# Altium schematic sheet Ethernet_Interface.SchDoc: STM32F446 CNC
size B; Author: AM; CompanyName: Expatria Technologies; DrawnBy: A.Marles; Engineer: AM; Organization: Expatria Technolgoies; Address1: PO Box 2084; Address3: Merritt, BC V1K 1B8; Address4: Canada; DocumentNumber: 7; SheetNumber: 7; SheetTotal: 26
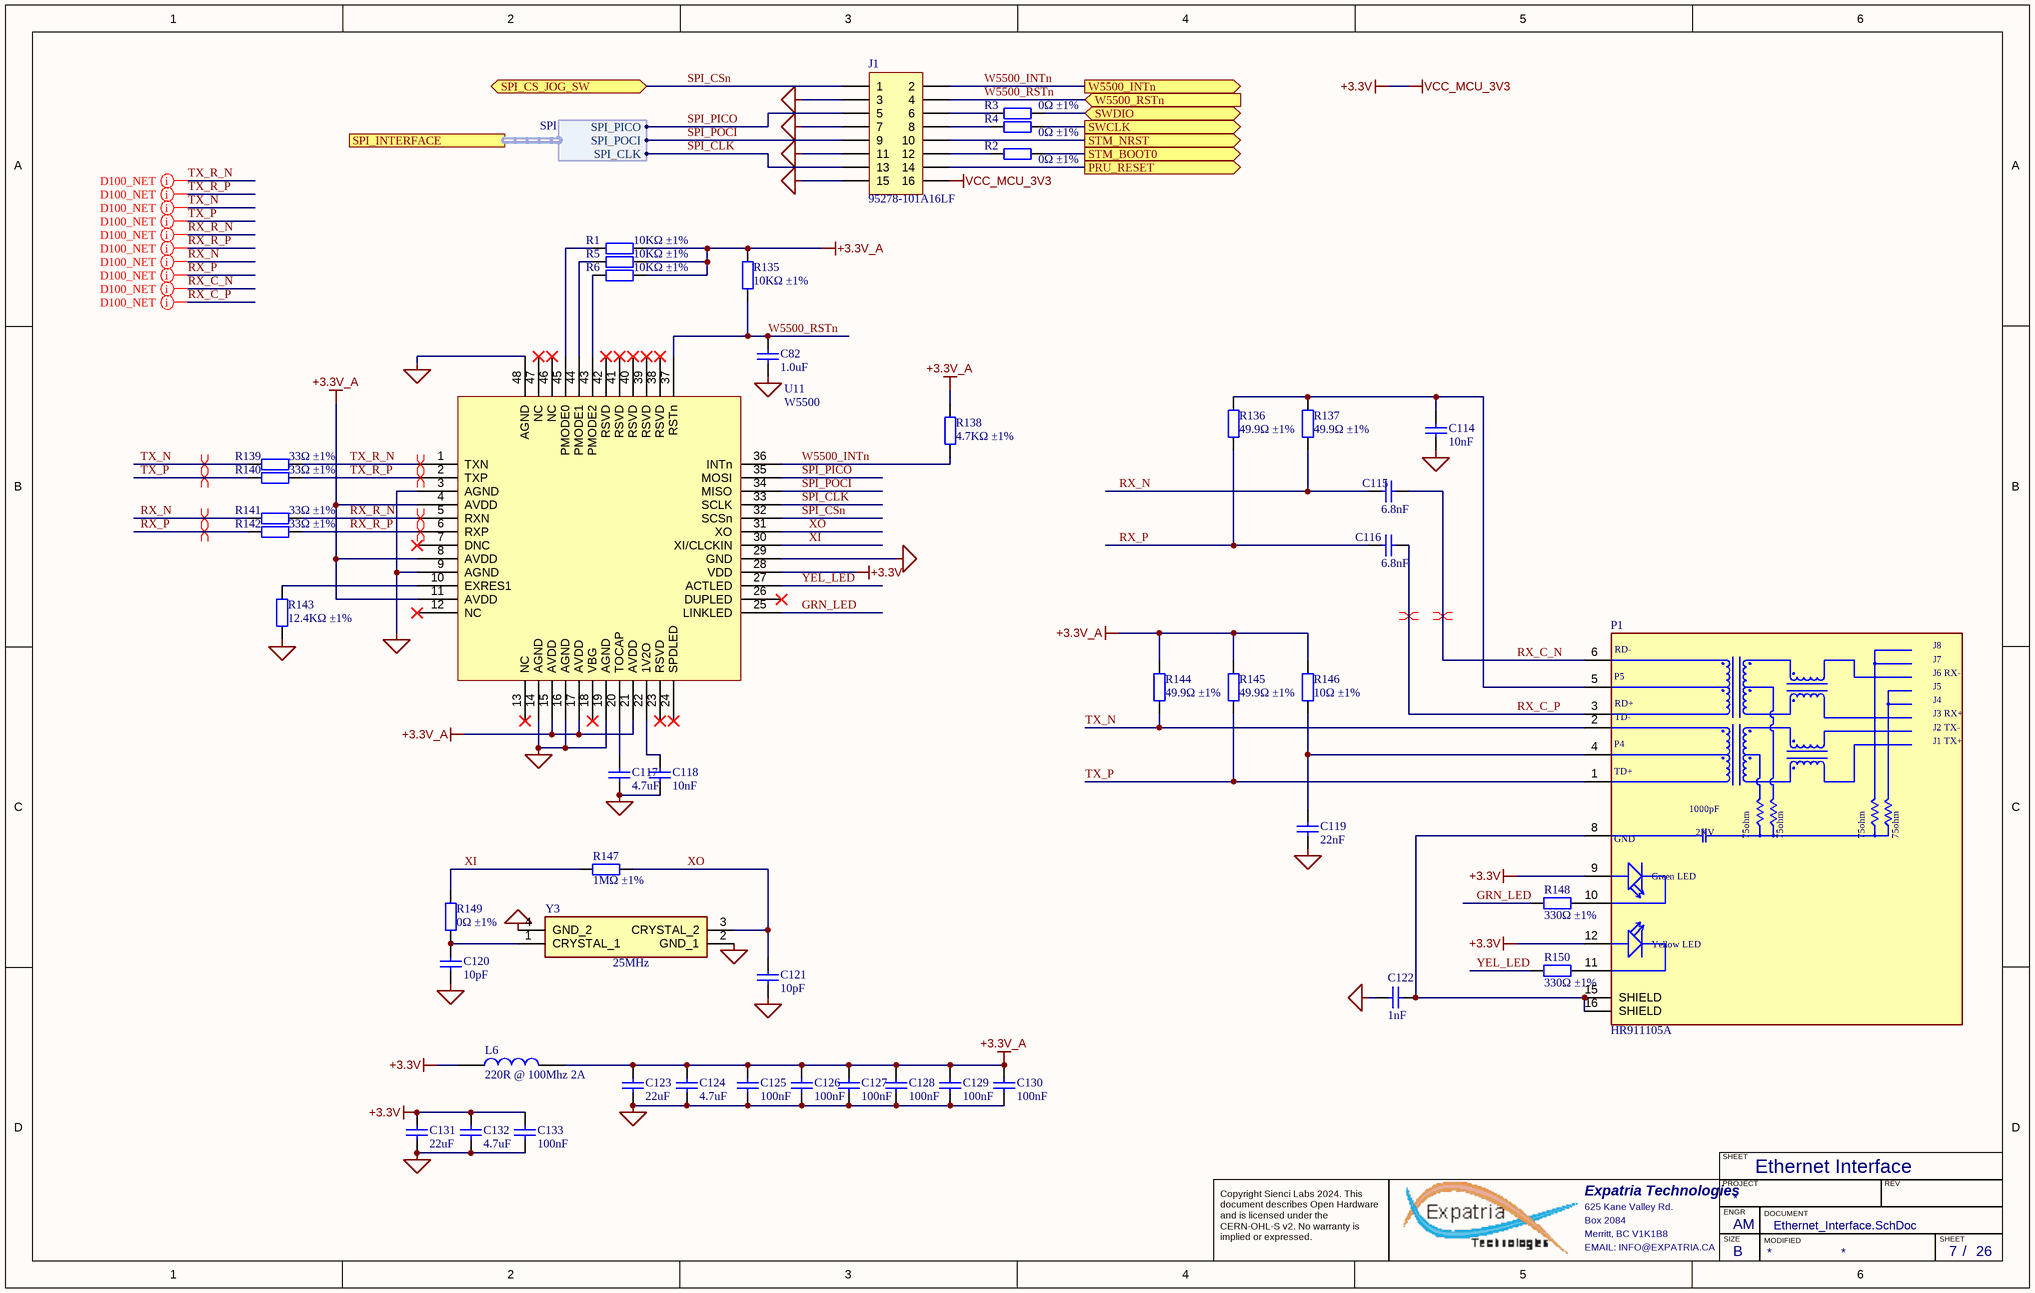
[diagram p0: Ethernet_Interface.SchDoc]

## Parts
C82  1.0uF  [0402_C]
C114  10nF  [0402_C]
C115  6.8nF  [0402_C]
C116  6.8nF  [0402_C]
C117  4.7uF  [0402_C]
C118  10nF  [0402_C]
C119  22nF  [0402_C]
C120  10pF  [0402_C]
C121  10pF  [0402_C]
C122  1nF  [1206_C]
C123  22uF  [0805_C]
C124  4.7uF  [0603_C]
C125  100nF  [0402_C]
C126  100nF  [0402_C]
C127  100nF  [0402_C]
C128  100nF  [0402_C]
C129  100nF  [0402_C]
C130  100nF  [0402_C]
C131  22uF  [0805_C]
C132  4.7uF  [0603_C]
C133  100nF  [0402_C]
J1  95278-101A16LF  [95278101A16LF]
L6  220R @ 100Mhz 2A  [0805_R]
P1  HR911105A  [HANRUN_HR911105A]
R1  10KΩ ±1%  [0402_R]
R2  0Ω ±1%  [0603_R]
R3  0Ω ±1%  [0603_R]
R4  0Ω ±1%  [0603_R]
R5  10KΩ ±1%  [0402_R]
R6  10KΩ ±1%  [0402_R]
R135  10KΩ ±1%  [0402_R]
R136  49.9Ω ±1%  [0402_R]
R137  49.9Ω ±1%  [0402_R]
R138  4.7KΩ ±1%  [0402_R]
R139  33Ω ±1%  [0402_R]
R140  33Ω ±1%  [0402_R]
R141  33Ω ±1%  [0402_R]
R142  33Ω ±1%  [0402_R]
R143  12.4KΩ ±1%  [0603_R]
R144  49.9Ω ±1%  [0402_R]
R145  49.9Ω ±1%  [0402_R]
R146  10Ω ±1%  [0402_R]
R147  1MΩ ±1%  [0402_R]
R148  330Ω ±1%  [0402_R]
R149  0Ω ±1%  [0402_R]
R150  330Ω ±1%  [0402_R]
U11  W5500  [LQFP-48_7x7x05P]
Y3  value 25MHz  [YSX321SL]  (hidden comment: X322525MSB4SI)

## Ports
PRU_RESET (out), SPI_CS_JOG_SW (bidir), SPI_INTERFACE (harness SPI), STM_BOOT0 (out), STM_NRST (out), SWCLK (out), SWDIO (bidir), W5500_INTn (out), W5500_RSTn (in)

## Harnesses
SPI: SPI_CLK, SPI_PICO, SPI_POCI

## Nets
+3.3V: C131.2 C132.2 C133.2 J1.16 L6.1 P1.9(GA) P1.12(YA) U11.28(VDD)  [also labelled VCC_MCU_3V3]
+3.3V_A: C123.2 C124.2 C125.2 C126.2 C127.2 C128.2 C129.2 C130.2 L6.2 R1.1 R5.1 R6.1 R135.1 R138.1 R144.1 R145.1 R146.1 U11.4(AVDD) U11.8(AVDD) U11.11(AVDD) U11.15(AVDD) U11.17(AVDD) U11.21(AVDD)
MCU_GND: C82.1 C114.1 C117.1 C118.1 C119.1 C120.1 C121.1 C122.1 C123.1 C124.1 C125.1 C126.1 C127.1 C128.1 C129.1 C130.1 C131.1 C132.1 C133.1 J1.3 J1.7 J1.11 J1.15 R143.1 U11.3(AGND) U11.9(AGND) U11.14(AGND) U11.16(AGND) U11.19(AGND) U11.29(GND) U11.48(AGND) Y3.2(GND_1) Y3.4(GND_2)
GRN_LED: R148.1 U11.25(LINKLED)
PRU_RESET: J1.14 ; port PRU_RESET
RX_C_N: C115.1 P1.6(RD-)
RX_C_P: C116.1 P1.3(RD+)
RX_N: C115.2 R137.2 R141.1
RX_P: C116.2 R136.2 R142.1
RX_R_N: R141.2 U11.5(RXN)
RX_R_P: R142.2 U11.6(RXP)
SPI_CLK: J1.13 U11.33(SCLK) ; port SPI_INTERFACE.SPI_CLK
SPI_CSn: J1.1 U11.32(SCSn) ; port SPI_CS_JOG_SW
SPI_PICO: J1.5 U11.35(MOSI) ; port SPI_INTERFACE.SPI_PICO
SPI_POCI: J1.9 U11.34(MISO) ; port SPI_INTERFACE.SPI_POCI
STM_BOOT0: R2.1 ; port STM_BOOT0
STM_NRST: J1.10 ; port STM_NRST
SWCLK: R4.1 ; port SWCLK
SWDIO: R3.1 ; port SWDIO
TX_N: P1.2(TD-) R139.1 R144.2
TX_P: P1.1(TD+) R140.1 R145.2
TX_R_N: R139.2 U11.1(TXN)
TX_R_P: R140.2 U11.2(TXP)
W5500_INTn: J1.2 R138.2 U11.36(INTn) ; port W5500_INTn
W5500_RSTn: C82.2 J1.4 R135.2 U11.37(RSTn) ; port W5500_RSTn
XI: R147.1 R149.1 U11.30(XI/CLCKIN)
XO: C121.2 R147.2 U11.31(XO) Y3.3(CRYSTAL_2)
YEL_LED: R150.1 U11.27(ACTLED)
NetC114_2: C114.2 P1.5(P5) R136.1 R137.1
NetC117_2: C117.2 U11.20(TOCAP)
NetC118_2: C118.2 U11.22(1V2O)
NetC119_2: C119.2 P1.4(P4) R146.2
NetC120_2: C120.2 R149.2 Y3.1(CRYSTAL_1)
NetC122_2: C122.2 P1.8(GND) P1.15(SHIELD) P1.16(SHIELD)
NetJ1_6: J1.6 R3.2
NetJ1_8: J1.8 R4.2
NetJ1_12: J1.12 R2.2
NetP1_10: P1.10(GC) R148.2
NetP1_11: P1.11(YC) R150.2
NetR1_2: R1.2 U11.45(PMODE0)
NetR5_2: R5.2 U11.44(PMODE1)
NetR6_2: R6.2 U11.43(PMODE2)
NetR143_2: R143.2 U11.10(EXRES1)

Not connected (* = marked no-connect by the designer): U11 7(DNC)* 12(NC)* 13(NC)* 18(VBG)* 23(RSVD)* 24(SPDLED)* 26(DUPLED)* 38(RSVD)* 39(RSVD)* 40(RSVD)* 41(RSVD)* 42(RSVD)* 46(NC)* 47(NC)*

## Layout directives
differential pair: RX_C_N, RX_C_P, RX_N, RX_P, RX_R_N, RX_R_P, TX_N, TX_P, TX_R_N, TX_R_P
net class D100_NET: RX_C_N, RX_C_P, RX_N, RX_P, RX_R_N, RX_R_P, TX_N, TX_P, TX_R_N, TX_R_P

## Notes on the sheet
- Ethernet Interface
- SHEET
- Expatria Technologies
- 625 Kane Valley Rd.
- Box 2084
- Merritt, BC V1K1B8
- PROJECT
- SIZE
- ENGR
- MODIFIED
- DOCUMENT
- REV
- Copyright Sienci Labs 2024. This document describes Open Hardware and is licensed under the CERN-OHL-S v2. No warranty is implied or expressed.
- EMAIL: INFO@EXPATRIA.CA
- B
- /
- (in symbol HR911105A) J8; J7; J6 RX-; J5; J4; J3 RX+; J2 TX-; J1 TX+; 1000pF; 2KV; 75ohm; Green LED; Yellow LED

## Library data of the parts
C82 = 0402 1.0uF (105) 10% 25V: Chip capacitor; Manufacturer: Samsung Electro-Mechanics; Manufacturer Part Number: CL05A105KA5NQNC; Capacitance: 1uF; Tolerance: 10%; Voltage: 25V; ComponentLink1Description: Supplier link; ComponentLink1URL: http://www.szlcsc.com/product/details_53938.html; Package: 0402; Supplier: LC; SuppliersPartNumber: C52923
C114 C118 = 0402 10nF (103) 10% 50V: Chip capacitors; Manufacturer: Samsung Electro-Mechanics; Manufacturer Part Number: CL05B103KB5NNNC; Tolerance: 10%; Voltage: 50V; ComponentLink1Description: Supplier link; ComponentLink1URL: http://www.szlcsc.com/product/details_15869.html; Package: 0402; Supplier: LC; SuppliersPartNumber: C15195; Capacitance: 10nF
C115 C116 = 0402 6.8nF (682) 10% 50V: Chip capacitors; Manufacturer: Guangdong Fenghua Advanced Tech; Manufacturer Part Number: 0402B682K500NT; Tolerance: 10%; Voltage: 50V; ComponentLink1Description: Supplier link; ComponentLink1URL: http://www.szlcsc.com/product/details_1894.html; Package: 0402; Supplier: LC; SuppliersPartNumber: C1542; Capacitance: 6.8nF
C117 = 0402 4.7uF (475) 20% 10V: Chip capacitor; Manufacturer: Samsung Electro-Mechanics; Manufacturer Part Number: CL05A475MP5NRNC; Tolerance: 20%; Voltage: 10V; ComponentLink1Description: Supplier link; ComponentLink1URL: http://www.szlcsc.com/product/details_24469.html; Package: 0402; Supplier: LC; SuppliersPartNumber: C23733; Capacitance: 4.7uF
C119 = 0402 22nF (223) 10% 50V: Chip capacitors; Manufacturer: Guangdong Fenghua Advanced Tech; Manufacturer Part Number: 0402B223K500NT; Tolerance: 10%; Voltage: 50V; ComponentLink1Description: Supplier link; ComponentLink1URL: http://www.szlcsc.com/product/details_1884.html; Package: 0402; Supplier: LC; SuppliersPartNumber: C1532; Capacitance: 22nF
C120 C121 = 0402 10pF (100) 5% 50V: Chip capacitors; Manufacturer: Samsung Electro-Mechanics; Manufacturer Part Number: CL05C100JB5NNNC; Tolerance: 5%; Voltage: 50V; ComponentLink1Description: Supplier link; ComponentLink1URL: http://www.szlcsc.com/product/details_33914.html; Package: 0402; Supplier: LC; SuppliersPartNumber: C32949; Capacitance: 10pF
C122 = 1206 1nF (102) 10% 500V: Chip capacitors; Manufacturer: Samsung Electro-Mechanics; Manufacturer Part Number: CL31B102KGFNNNE; Tolerance: 10%; Voltage: 500V; ComponentLink1Description: Supplier link; ComponentLink1URL: http://www.szlcsc.com/product/details_36187.html; Package: 1206; Supplier: LC; SuppliersPartNumber: C35216; Capacitance: 1nF
C123 C131 = 0805 22uF (226) 20% 25V: 25V 22uF X5R ±20% 0805 Multilayer Ceramic Capacitors MLCC - SMD/SMT ROHS; Manufacturer: Samsung Electro-Mechanics; Manufacturer Part Number: CL21A226MAQNNNE; ComponentLink1Description: Supplier link; ComponentLink1URL: http://www.szlcsc.com/product/details_46786.html; Package: 0805; Supplier: LC; SuppliersPartNumber: C45783; Capacitance: 22uF; Tolerance: 20%; Voltage: 25V
C124 C132 = 0603 4.7uF (475) 10% 16V: 16V 4.7uF X5R ±10% 0603 Multilayer Ceramic Capacitors MLCC - SMD/SMT ROHS; Manufacturer: Samsung Electro-Mechanics; Manufacturer Part Number: CL10A475KO8NNNC; ComponentLink1Description: Supplier link; ComponentLink1URL: http://www.szlcsc.com/product/details_20375.html; Package: 0603; Supplier: LC; SuppliersPartNumber: C19666; Capacitance: 4.7uF; Tolerance: 10%; Voltage: 16V
C125-C130 C133 = 0402 100nF (104) 10% 16V: 16V 100nF X7R ±10% 0402 Multilayer Ceramic Capacitors MLCC - SMD/SMT ROHS; Manufacturer: Samsung Electro-Mechanics; Manufacturer Part Number: CL05B104KO5NNNC; ComponentLink1Description: Supplier link; ComponentLink1URL: http://www.szlcsc.com/product/details_1877.html; Package: 0402; Supplier: LC; SuppliersPartNumber: C1525; Capacitance: 100nF; Tolerance: 10%; Voltage: 16V
J1 = 95278-101A16LF: Conn Unshrouded Header HDR 16 POS 2.54mm Solder ST Top Entry SMD BergStik® T/R; Manufacturer: Amphenol ICC / FCI; Supplier 1: LCSC; Manufacturer Part Number: 95278-101A16LF; RoHS: No; Category: Headers and Wire Housings; ComponentLink1URL: https://datasheet.ciiva.com/46395/95278-46395817.pdf?src-supplier=Element14; ComponentLink1Description: https://datasheet.ciiva.com/46395/95278-46395817.pdf?src-supplier=Element14; SuppliersPartNumber: C188235; Supplier: LCSC; Supplier Part Number 1: C188235; Value: 95278-101A16LF
L6 = CBW201209U221T: 150mΩ ±25% 220Ω@100MHz 0805 Ferrite Beads ROHS; Manufacturer: FH (Guangdong Fenghua Advanced Tech); Package: 0402; Supplier: LC; SuppliersPartNumber: C139188; Manufacturer Part Number: CBW201209U221T
P1 = HR911105A: HR911105A Ethernet Interface Arduino Platform Evaluation Expansion Board; Manufacturer: DFRobot; SuppliersPartNumber: C163507; Value: HR911105A; Manufacturer Part Number: HR911105A
R1 R5 R6 R135 = 0402 10K (1002) 1%: Chip resistor; Manufacturer: Uniroyal Elec; Manufacturer Part Number: 0402WGF1002TCE; Power: 1/16W; ComponentLink1Description: Supplier link; ComponentLink1URL: http://www.szlcsc.com/product/details_26487.html; Package: 0402; Supplier: LC; SuppliersPartNumber: C25744; Resistance: 10KΩ; Tolerance: 1%
R2-R4 = 0603 0R (0R0) 1%: Chip resistor; Manufacturer: Uniroyal Elec; Manufacturer Part Number: 0603WAF0000T5E; Power: 1/10W; ComponentLink1Description: Supplier link; ComponentLink1URL: http://www.szlcsc.com/product/details_21903.html; Package: 0603; Supplier: LCSC; SuppliersPartNumber: C21189; Resistance: 0Ω; Tolerance: 1%
R136 R137 R144 R145 = 0402 49.9R (49R9) 1%: Chip resistor; Manufacturer: Uniroyal Elec; Manufacturer Part Number: 0402WGF499JTCE; Power: 1/16W; ComponentLink1Description: Supplier link; ComponentLink1URL: http://www.szlcsc.com/product/details_25863.html; Package: 0402; Supplier: LC; SuppliersPartNumber: C25120; Resistance: 49.9Ω; Tolerance: 1%
R138 = 0402 4.7K (4701) 1%: Chip resistor; Manufacturer: Uniroyal Elec; Manufacturer Part Number: 0402WGF4701TCE; Power: 1/16W; ComponentLink1Description: Supplier link; ComponentLink1URL: http://www.szlcsc.com/product/details_26643.html; Package: 0402; Supplier: LC; SuppliersPartNumber: C25900; Resistance: 4.7KΩ; Tolerance: 1%
R139-R142 = 0402 33R (33R0) 1%: Chip resistor; Manufacturer: Uniroyal Elec; Manufacturer Part Number: 0402WGF330JTCE; Power: 1/16W; ComponentLink1Description: Supplier link; ComponentLink1URL: http://www.szlcsc.com/product/details_25848.html; Package: 0402; Supplier: LC; SuppliersPartNumber: C25105; Resistance: 33Ω; Tolerance: 1%
R143 = 0603 10K (1002) 1%: Chip resistor; Manufacturer: Uniroyal Elec; Manufacturer Part Number: 0603WAF1242T5E; Power: 1/10W; Resistance: 12.4K; ComponentLink1Description: Supplier link; ComponentLink1URL: http://www.szlcsc.com/product/details_26547.html; Package: 0603; Supplier: LC; SuppliersPartNumber: C22865; Tolerance: 1%
R146 = 0402 10R (10R0) 1%: Chip resistor; Manufacturer: Uniroyal Elec; Manufacturer Part Number: 0402WGF100JTCE; Power: 1/16W; ComponentLink1Description: Supplier link; ComponentLink1URL: http://www.szlcsc.com/product/details_25820.html; Package: 0402; Supplier: LC; SuppliersPartNumber: C25077; Resistance: 10Ω; Tolerance: 1%
R147 = 0402 1M (1004) 1%: Chip resistor; Manufacturer: Uniroyal Elec; Manufacturer Part Number: 0402WGF1004TCE; Power: 1/16W; ComponentLink1Description: Supplier link; ComponentLink1URL: http://www.szlcsc.com/product/details_26826.html; Package: 0402; Supplier: LC; SuppliersPartNumber: C26083; Resistance: 1MΩ; Tolerance: 1%
R148 R150 = 0402 330R (3300) 1%: Chip resistor; Manufacturer: Uniroyal Elec; Manufacturer Part Number: 0402WGF3300TCE; Power: 1/16W; ComponentLink1Description: Supplier link; ComponentLink1URL: http://www.szlcsc.com/product/details_25847.html; Package: 0402; Supplier: LC; SuppliersPartNumber: C25104; Resistance: 330Ω; Tolerance: 1%
R149 = 0402 0R (0R0) 1%: Chip resistor; Manufacturer: Uniroyal Elec; Manufacturer Part Number: 0402WGF0000TCE; Power: 1/16W; ComponentLink1Description: Supplier link; ComponentLink1URL: http://www.szlcsc.com/product/details_17853.html; Package: 0402; Supplier: LC; SuppliersPartNumber: C17168; Resistance: 0Ω; Tolerance: 1%
U11 = W5500_[C32843]: Ethernet Controllers 2.97V ~ 3.63V 10/100 Base-T/TX PHY SPI LQFP-48_7x7x05P Ethernet ICs ROHS; Manufacturer: WIZNET; ComponentLink1Description: 供应商链接; ComponentLink1URL: http://www.szlcsc.com/product/details_33808.html; Package: LQFP-48_7x7x05P; Supplier: LC; SuppliersPartNumber: C32843; Manufacturer Part Number: W5500
Y3 = X322525MSB4SI: 25MHz SMD Crystal Resonator 20pF ±10ppm ±30ppm -40℃~+85℃ SMD3225-4P Crystals ROHS; Manufacturer 1: Yangxing Tech; Height: 0.8mm; SuppliersPartNumber: C13740; Supplier 1: LCSC; Supplier Part Number 1: C13740; Manufacturer Part Number 1: X322525MSB4SI; Manufacturer: Yangxing Tech; Manufacturer Part Number: X322525MSB4SI